# Altium schematic sheet Power.SchDoc
size A3; Author: Nguyễn Hữu Thắng; DrawnBy: Nguyễn Hữu Thắng; SheetNumber: 18; SheetTotal: 35
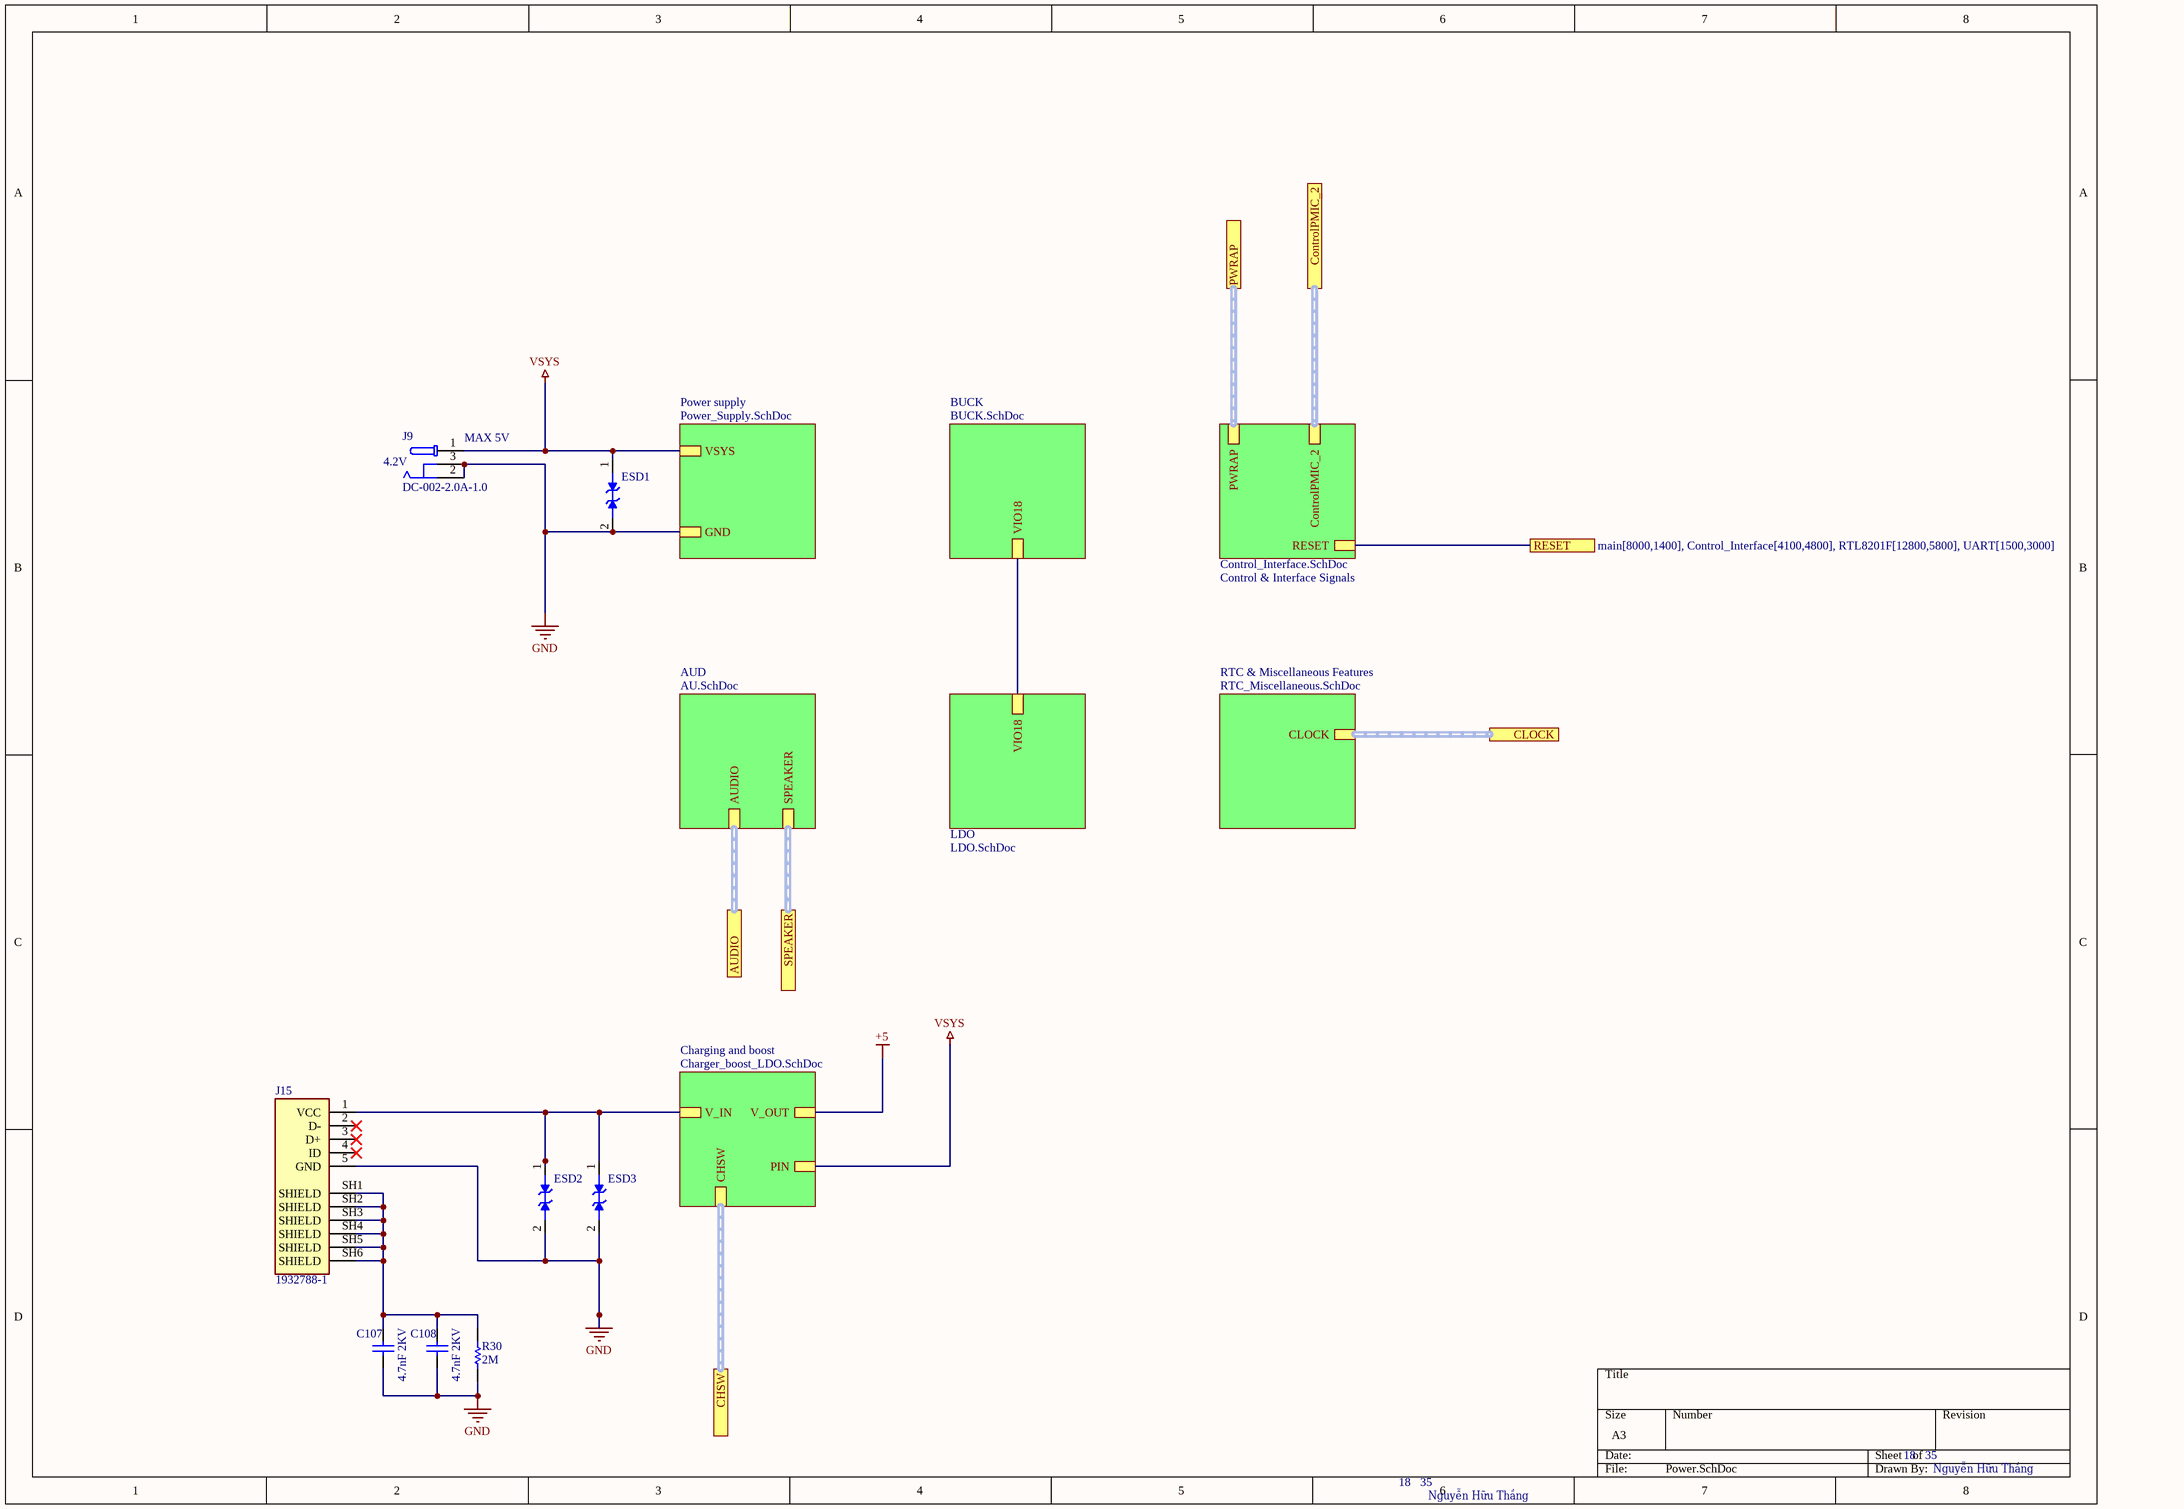
[diagram p0: Power.SchDoc]

## Parts
C107  value 4.7nF 2KV  [C1210]  (hidden comment: C1210)
C108  value 4.7nF 2KV  [C1210]  (hidden comment: C1210)
ESD1  ESD9B5.0ST5G  [SODFL1006X40N]  (value not drawn)
ESD2  ESD9B5.0ST5G  [SODFL1006X40N]  (value not drawn)
ESD3  ESD9B5.0ST5G  [SODFL1006X40N]  (value not drawn)
J9  DC-002-2.0A-1.0  [DC00220A10]
J15  1932788-1  [TE_1932788-1]
R30  value 2M  [R0603]  (hidden comment: R0603)

## Sub-sheets
AUD = AU.SchDoc: AUDIO, SPEAKER
BUCK = BUCK.SchDoc: VIO18
Charging and boost = Charger_boost_LDO.SchDoc: V_IN, V_OUT, PIN, CHSW
Control & Interface Signals = Control_Interface.SchDoc: PWRAP, ControlPMIC_2, RESET
LDO = LDO.SchDoc: VIO18
Power supply = Power_Supply.SchDoc: VSYS, GND
RTC & Miscellaneous Features = RTC_Miscellaneous.SchDoc: CLOCK

## Ports
AUDIO (see main[7600,2000], AU[6600,8200], MT8365[10000,5800], MT8365_AUD[2500,6000]), CHSW (see main[7900,2000], Charger_boost_LDO[1400,3400], I2C_Switch[500,7800]), CLOCK (see main[6700,2000], MT8365[11000,4500], MT8365_Other[1500,5800], RTC_Miscellaneous[2500,1800]), ControlPMIC_2 (see main[7300,2000], Control_Interface[3100,2200], MT8365[11000,4800], MT8365_Other[1000,3700]), PWRAP (see main[7000,2000], Control_Interface[3900,4400], MT8365[5500,9000], MT8365_CONN[4500,8700]), RESET (see main[8000,1400], Control_Interface[4100,4800], RTL8201F[12800,5800], UART[1500,3000]), SPEAKER (see main[5000,1100], AU[14100,7200], AUDIO_AMP[397.796,3600])

## Nets
+5: sheet Charging and boost/V_OUT
GND: C107.1 C108.1 ESD1.2(A1) ESD2.2(A1) ESD3.2(A1) J9.2 J9.3 J15.5(GND) R30.2 ; sheet Power supply/GND
VSYS: ESD1.1(A) J9.1 ; sheet Power supply/VSYS, sheet Charging and boost/PIN
RESET: port RESET, sheet Control & Interface Signals/RESET
NetC107_2: C107.2 C108.2 J15.SH1(SHIELD) J15.SH2(SHIELD) J15.SH3(SHIELD) J15.SH4(SHIELD) J15.SH5(SHIELD) J15.SH6(SHIELD) R30.1
NetESD2_1: ESD2.1(A) ESD3.1(A) J15.1(VCC) ; sheet Charging and boost/V_IN
(unnamed): sheet BUCK/VIO18, sheet LDO/VIO18

Not connected (* = marked no-connect by the designer): J15 2(D-)* 3(D+)* 4(ID)*

## Buses and harness runs
harness port AUDIO = sheet AUD/AUDIO
harness port CHSW = sheet Charging and boost/CHSW
harness port CLOCK = sheet RTC & Miscellaneous Features/CLOCK
harness port ControlPMIC_2 = sheet Control & Interface Signals/ControlPMIC_2
harness port PWRAP = sheet Control & Interface Signals/PWRAP
harness port SPEAKER = sheet AUD/SPEAKER

## Notes on the sheet
- (near J9) MAX 5V
- (near J9) 4.2V

## Library data of the parts
ESD1-ESD3 = ESD9B5.0ST5G: Clamp Ipp Tvs Diode Surface Mount SOD-923
J9 = DC-002-2.0A-1.0: Connector; Manufacturer_Name: XKB Connectivity; Datasheet Link: http://www.helloxkb.com/public/images/pdf/DC-002-2.0A-1.0.pdf; Height: 7.6mm; Manufacturer_Part_Number: DC-002-2.0A-1.0